# EasyEDA schematic SCH_URM07-Test_2025-04-24.json
TITLE: Sheet_1; REV: 1.0; Date: 2025-04-24; Sheet: 1/1; Drawn By: dgasparyan073; Company: Your Company
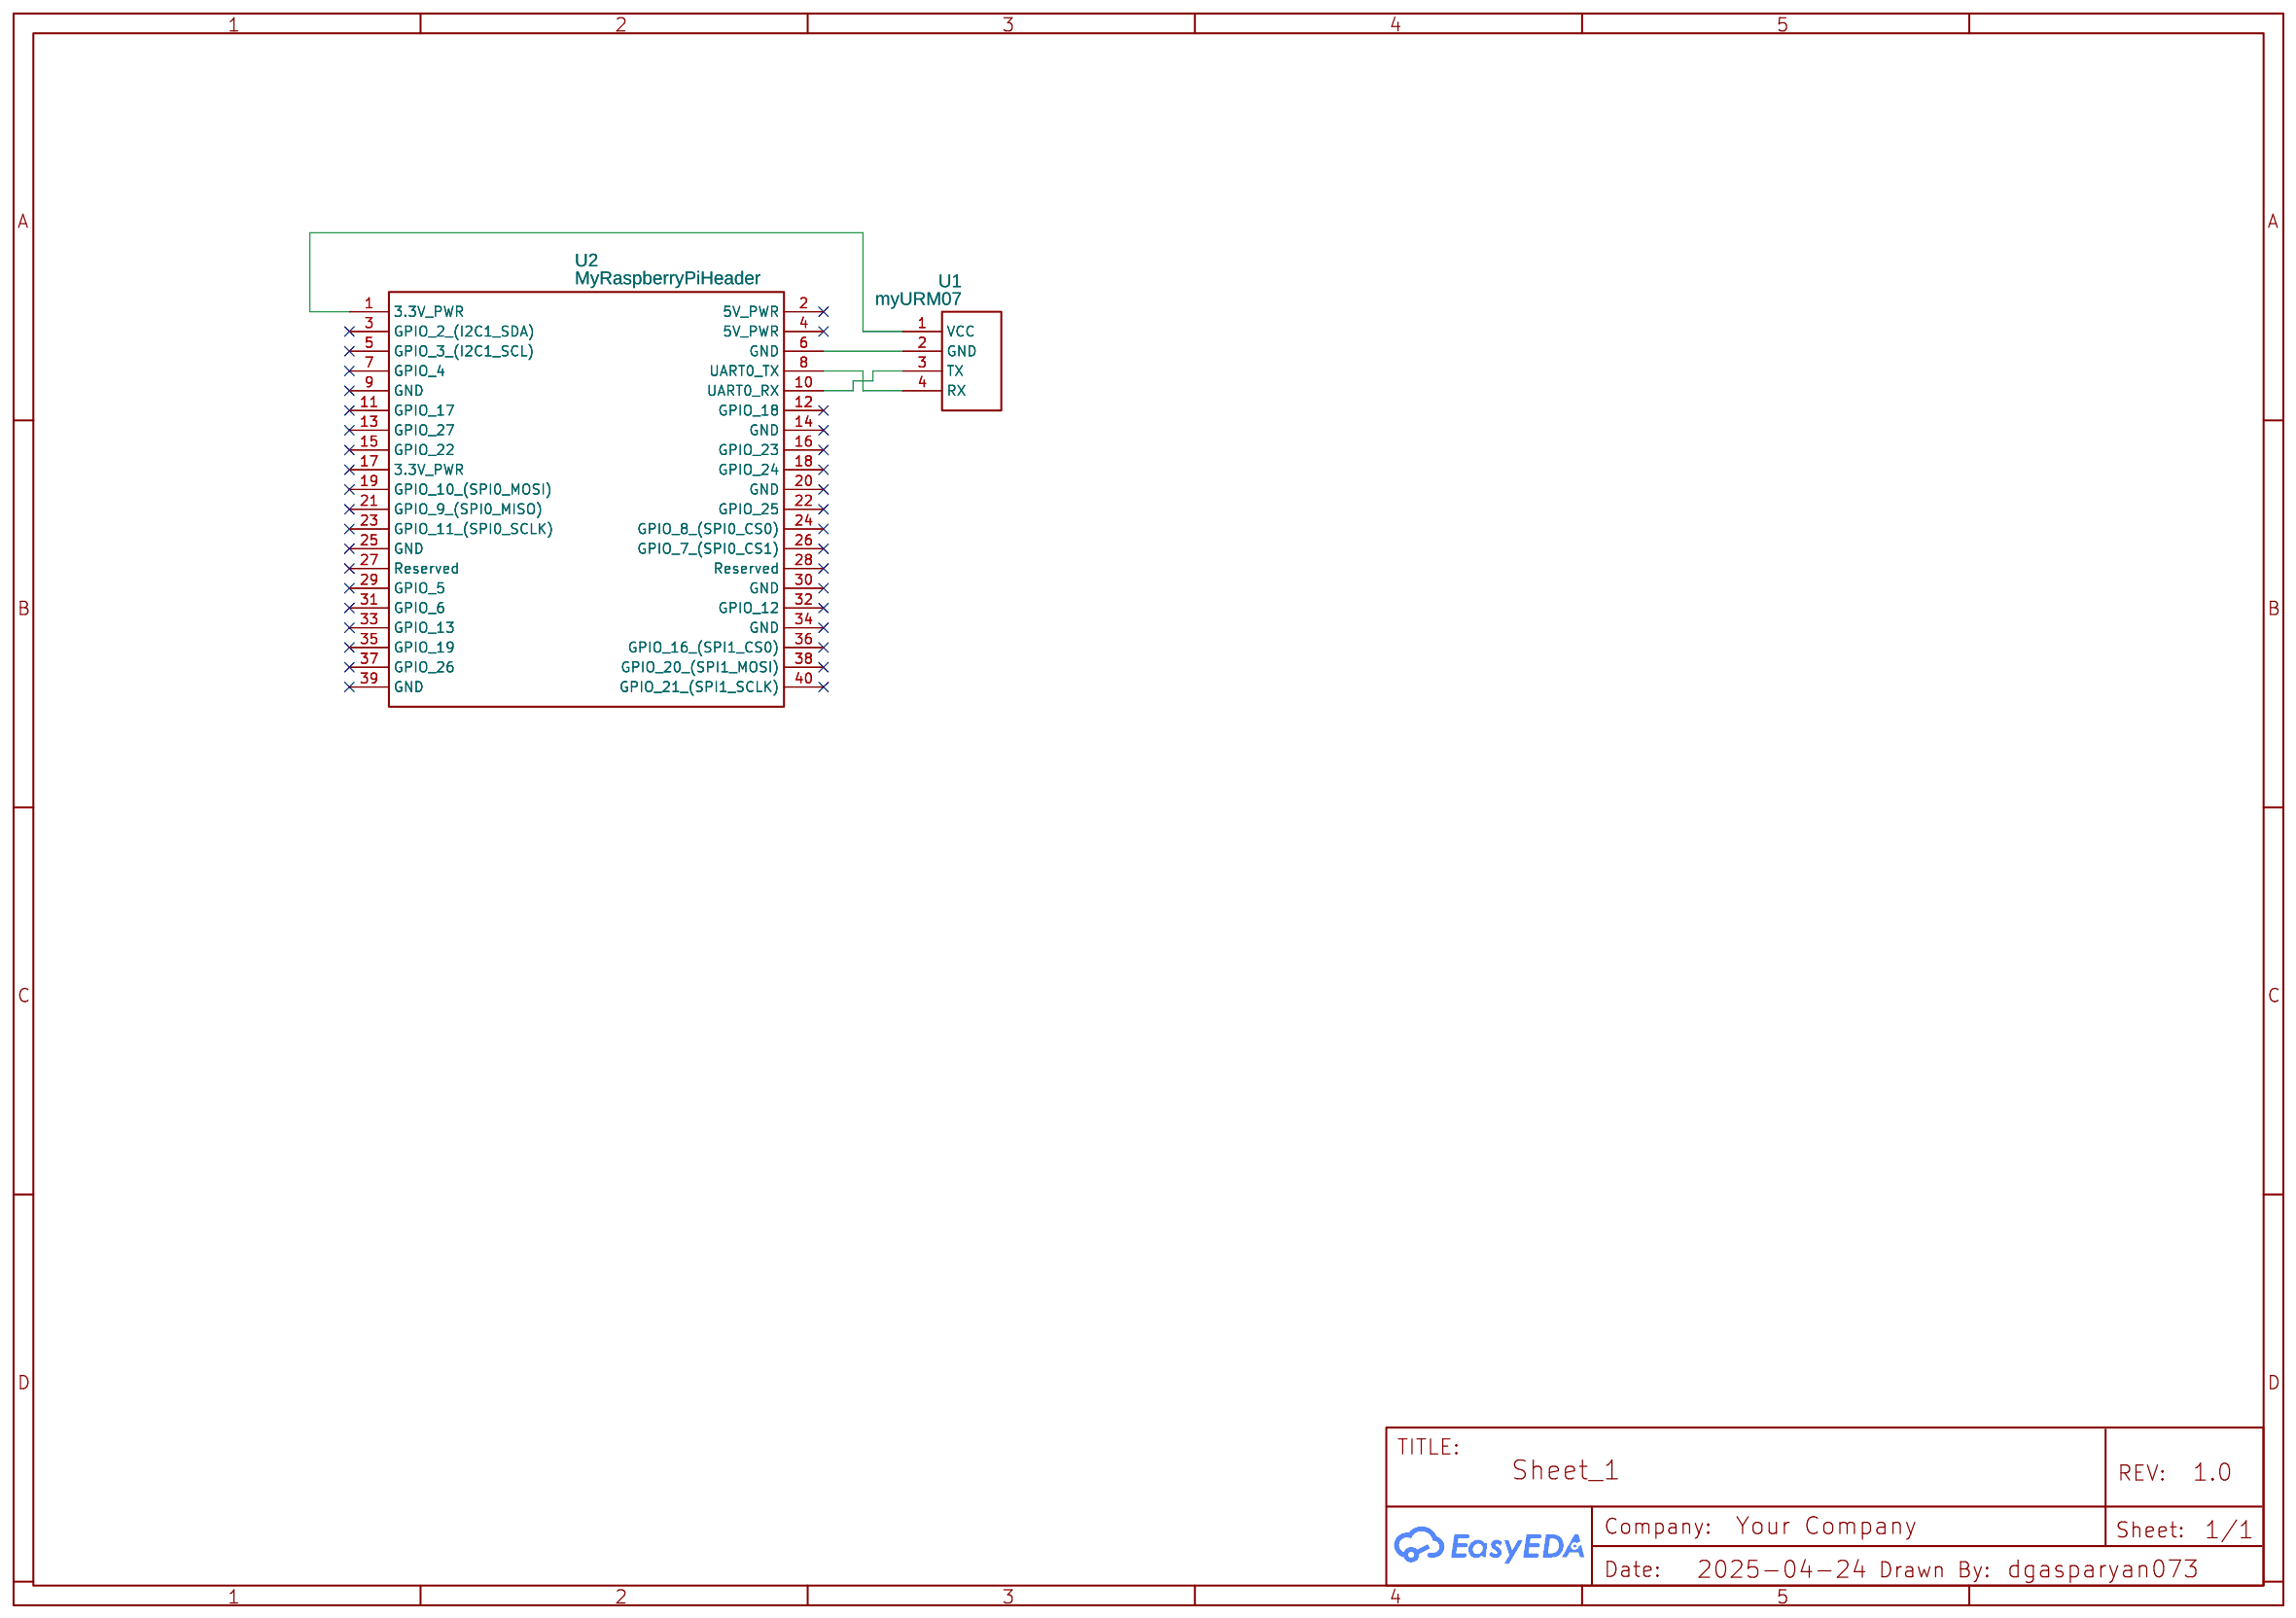
[diagram p0: schematic sheet]

## Parts
U1  myURM07  [MY_URM07]
U2  MyRaspberryPiHeader  [MY_RASPBERRY_PI_HEADER]

## Library data of the parts
U1 = myURM07: Contributor: dgasparyan073
U2 = MyRaspberryPiHeader: Contributor: dgasparyan073

## Nets
Net-(U1-1): U1.1(VCC) U2.1(3.3V PWR)
Net-(U1-2): U1.2(GND) U2.6(GND)
Net-(U1-3): U1.3(TX) U2.10(UART0 RX)
Net-(U1-4): U1.4(RX) U2.8(UART0 TX)

Not connected (* = marked no-connect by the designer): U2 2(5V PWR)* 3(GPIO 2 (I2C1 SDA))* 4(5V PWR)* 5(GPIO 3 (I2C1 SCL))* 7(GPIO 4)* 9(GND)* 11(GPIO 17)* 12(GPIO 18)* 13(GPIO 27)* 14(GND)* 15(GPIO 22)* 16(GPIO 23)* 17(3.3V PWR)* 18(GPIO 24)* 19(GPIO 10 (SPI0 MOSI))* 20(GND)* 21(GPIO 9 (SPI0 MISO))* 22(GPIO 25)* 23(GPIO 11 (SPI0 SCLK))* 24(GPIO 8 (SPI0 CS0))* 25(GND)* 26(GPIO 7 (SPI0 CS1))* 27(Reserved)* 28(Reserved)* 29(GPIO 5)* 30(GND)* 31(GPIO 6)* 32(GPIO 12)* 33(GPIO 13)* 34(GND)* 35(GPIO 19)* 36(GPIO 16 (SPI1 CS0))* 37(GPIO 26)* 38(GPIO 20 (SPI1 MOSI))* 39(GND)* 40(GPIO 21 (SPI1 SCLK))*
